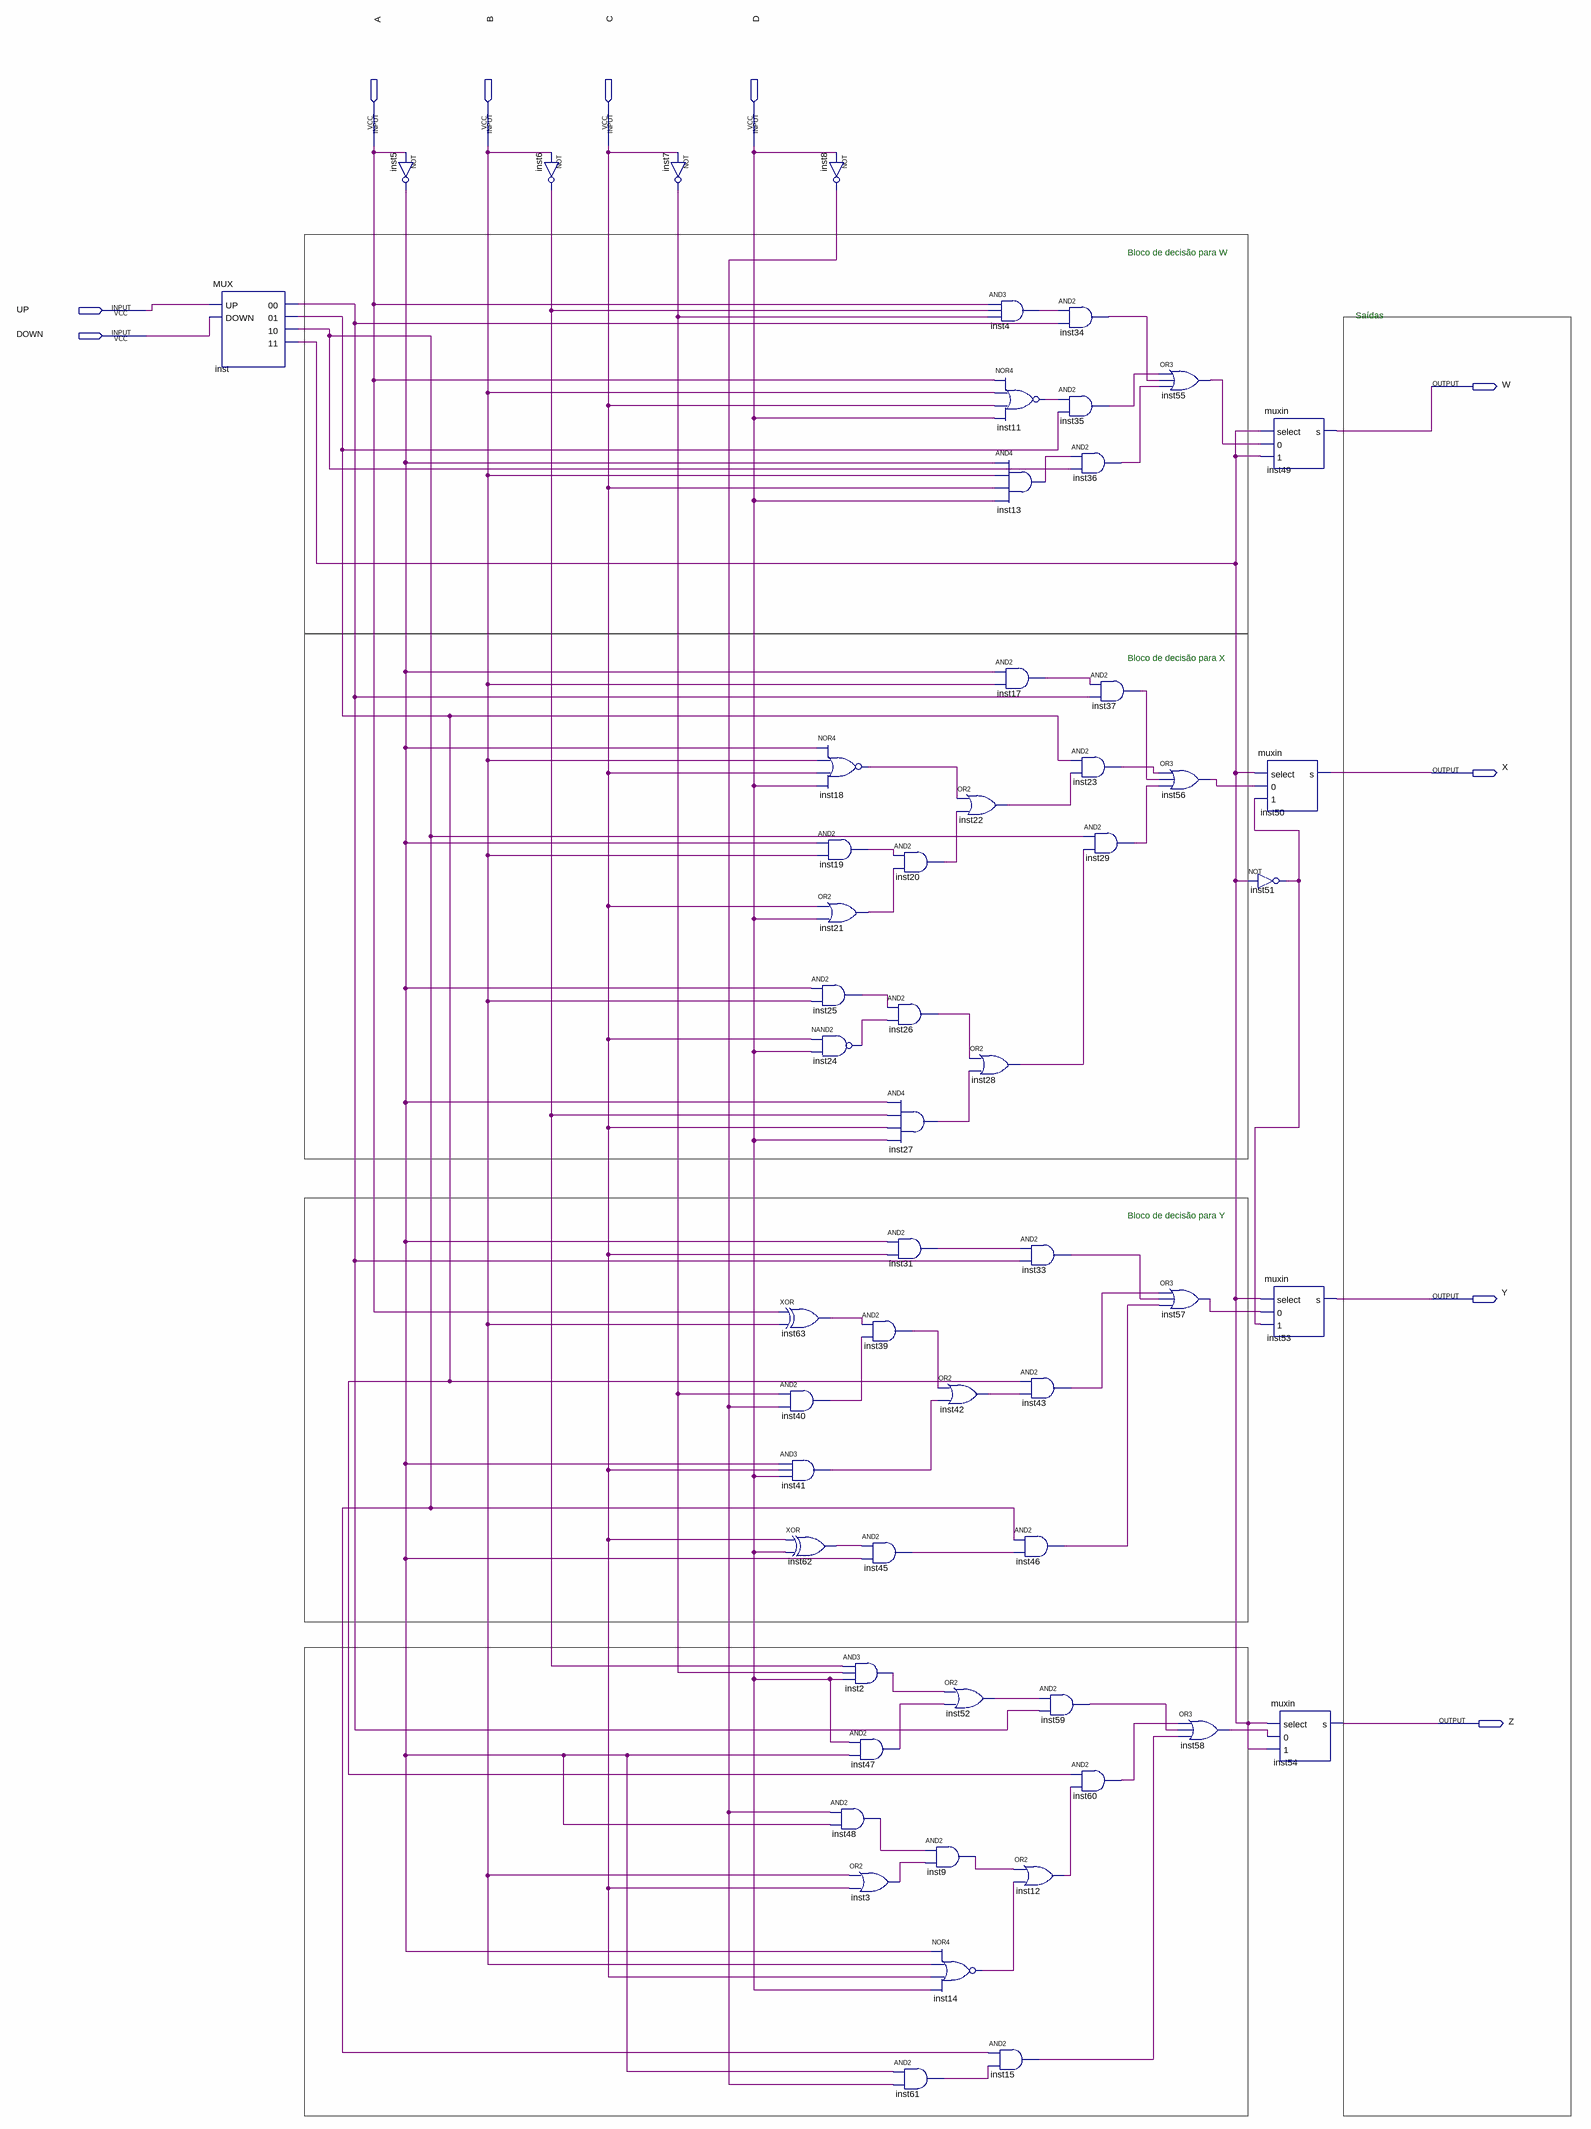
[diagram p0: schematic sheet]
// Quartus schematic nextstate.bdf as structural Verilog: 57 symbols, 10 pins
module nextstate (
  input  A,
  input  B,
  input  C,
  input  D,
  input  UP,
  input  DOWN,
  output W,
  output X,
  output Y,
  output Z
);

  wire inst2_out, inst3_out, inst4_out, inst5_out, inst6_out, inst7_out, inst8_out, inst9_out, inst11_out,
       inst12_out, inst13_out, inst14_out, inst15_out, inst17_out, inst18_out, inst19_out, inst20_out,
       inst21_out, inst22_out, inst23_out, inst24_out, inst25_out, inst26_out, inst27_out, inst28_out,
       inst29_out, inst31_out, inst33_out, inst34_out, inst35_out, inst36_out, inst37_out, inst39_out,
       inst40_out, inst41_out, inst42_out, inst43_out, inst45_out, inst46_out, inst47_out, inst48_out,
       inst51_out, inst52_out, inst55_out, inst56_out, inst57_out, inst58_out, inst59_out, inst60_out,
       inst61_out, inst62_out, inst63_out, inst_00, inst_01, inst_10, inst_11;

  MUX inst (.UP(UP), .DOWN(DOWN), .\00 (inst_00), .\01 (inst_01), .\10 (inst_10), .\11 (inst_11));
  not inst5 (inst5_out, A);
  not inst6 (inst6_out, B);
  not inst7 (inst7_out, C);
  and inst25 (inst25_out, inst5_out, B);
  nand inst24 (inst24_out, C, D);
  xor inst63 (inst63_out, A, B);
  and inst40 (inst40_out, inst7_out, inst8_out);
  and inst41 (inst41_out, inst5_out, C, D);
  xor inst62 (inst62_out, C, D);
  not inst8 (inst8_out, D);
  nor inst18 (inst18_out, inst5_out, B, C, D);
  and inst19 (inst19_out, inst5_out, B);
  or inst21 (inst21_out, C, D);
  and inst39 (inst39_out, inst63_out, inst40_out);
  and inst45 (inst45_out, inst62_out, inst5_out);
  and inst2 (inst2_out, inst6_out, inst7_out, D);
  and inst47 (inst47_out, D, inst5_out);
  and inst48 (inst48_out, inst8_out, inst5_out);
  or inst3 (inst3_out, B, C);
  and inst20 (inst20_out, inst19_out, inst21_out);
  and inst26 (inst26_out, inst25_out, inst24_out);
  and inst27 (inst27_out, inst5_out, inst6_out, C, D);
  and inst31 (inst31_out, inst5_out, C);
  and inst61 (inst61_out, inst5_out, inst8_out);
  or inst22 (inst22_out, inst18_out, inst20_out);
  or inst42 (inst42_out, inst39_out, inst41_out);
  or inst52 (inst52_out, inst2_out, inst47_out);
  and inst9 (inst9_out, inst48_out, inst3_out);
  nor inst14 (inst14_out, inst5_out, B, C, D);
  and inst4 (inst4_out, A, inst6_out, inst7_out);
  nor inst11 (inst11_out, A, B, C, D);
  and inst13 (inst13_out, inst5_out, B, C, D);
  and inst17 (inst17_out, inst5_out, B);
  or inst28 (inst28_out, inst26_out, inst27_out);
  and inst46 (inst46_out, inst_10, inst45_out);
  or inst12 (inst12_out, inst9_out, inst14_out);
  and inst15 (inst15_out, inst_10, inst61_out);
  and inst34 (inst34_out, inst4_out, inst_00);
  and inst35 (inst35_out, inst11_out, inst_01);
  and inst33 (inst33_out, inst31_out, inst_00);
  and inst43 (inst43_out, inst_01, inst42_out);
  and inst59 (inst59_out, inst52_out, inst_00);
  and inst36 (inst36_out, inst13_out, inst_10);
  and inst37 (inst37_out, inst17_out, inst_00);
  and inst23 (inst23_out, inst_01, inst22_out);
  and inst29 (inst29_out, inst_10, inst28_out);
  and inst60 (inst60_out, inst_01, inst12_out);
  or inst55 (inst55_out, inst35_out, inst34_out, inst36_out);
  or inst56 (inst56_out, inst23_out, inst37_out, inst29_out);
  or inst57 (inst57_out, inst43_out, inst33_out, inst46_out);
  or inst58 (inst58_out, inst60_out, inst59_out, inst15_out);
  muxin inst49 (.select(inst_11), .\0 (inst55_out), .\1 (inst_11), .s(W));
  muxin inst50 (.select(inst_11), .\0 (inst56_out), .\1 (inst51_out), .s(X));
  not inst51 (inst51_out, inst_11);
  muxin inst53 (.select(inst_11), .\0 (inst57_out), .\1 (inst51_out), .s(Y));
  muxin inst54 (.select(inst_11), .\0 (inst58_out), .\1 (inst_11), .s(Z));

  // Notes on the sheet:
  //   Bloco de decisão para W
  //   Saídas
  //   Bloco de decisão para X
  //   Bloco de decisão para Y
endmodule
